# Altium schematic sheet IO_ENC.SchDoc
size 381 x 241 mm; SheetNumber: 8; SheetTotal: 8
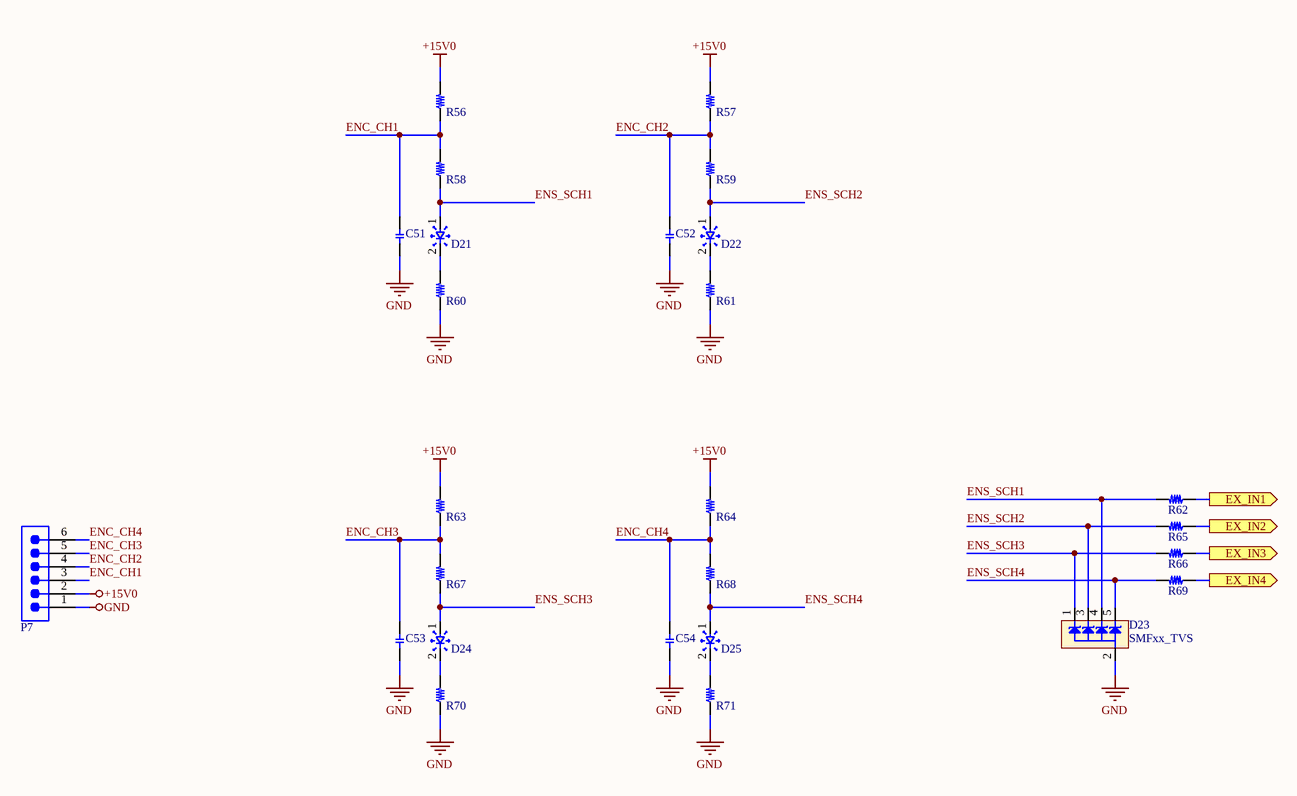
[diagram p0: IO_ENC.SchDoc]

## Parts
C51  CAP_SMD  [C 0603]  (value not drawn)
C52  CAP_SMD  [C 0603]  (value not drawn)
C53  CAP_SMD  [C 0603]  (value not drawn)
C54  CAP_SMD  [C 0603]  (value not drawn)
D21  LED_SMD  [D 0603]  (value not drawn)
D22  LED_SMD  [D 0603]  (value not drawn)
D23  SMFxx_TVS  [SOT353-5]
D24  LED_SMD  [D 0603]  (value not drawn)
D25  LED_SMD  [D 0603]  (value not drawn)
P7  691321300006  [691321300006]  (value not drawn)
R56  RES_SMD  [R 1206]  (value not drawn)
R57  RES_SMD  [R 1206]  (value not drawn)
R58  RES_SMD  [R 0603]  (value not drawn)
R59  RES_SMD  [R 0603]  (value not drawn)
R60  RES_SMD  [R 0603]  (value not drawn)
R61  RES_SMD  [R 0603]  (value not drawn)
R62  RES_SMD  [R 0603]  (value not drawn)
R63  RES_SMD  [R 1206]  (value not drawn)
R64  RES_SMD  [R 1206]  (value not drawn)
R65  RES_SMD  [R 0603]  (value not drawn)
R66  RES_SMD  [R 0603]  (value not drawn)
R67  RES_SMD  [R 0603]  (value not drawn)
R68  RES_SMD  [R 0603]  (value not drawn)
R69  RES_SMD  [R 0603]  (value not drawn)
R70  RES_SMD  [R 0603]  (value not drawn)
R71  RES_SMD  [R 0603]  (value not drawn)

## Ports
EX_IN1 (out), EX_IN2 (out), EX_IN3 (out), EX_IN4 (out)

## Nets
+15V0: P7.2 R56.2 R57.2 R63.2 R64.2
GND: C51.1 C52.1 C53.1 C54.1 D23.2(GND) P7.1 R60.1 R61.1 R70.1 R71.1
ENC_CH1: C51.2 P7.3 R56.1 R58.2
ENC_CH2: C52.2 P7.4 R57.1 R59.2
ENC_CH3: C53.2 P7.5 R63.1 R67.2
ENC_CH4: C54.2 P7.6 R64.1 R68.2
ENS_SCH1: D21.1 D23.4(K3) R58.1 R62.2
ENS_SCH2: D22.1 D23.3(K2) R59.1 R65.2
ENS_SCH3: D23.1(K1) D24.1 R66.2 R67.1
ENS_SCH4: D23.5(K4) D25.1 R68.1 R69.2
EX_IN1: R62.1 ; port EX_IN1
EX_IN2: R65.1 ; port EX_IN2
EX_IN3: R66.1 ; port EX_IN3
EX_IN4: R69.1 ; port EX_IN4
NetD21_2: D21.2 R60.2
NetD22_2: D22.2 R61.2
NetD24_2: D24.2 R70.2
NetD25_2: D25.2 R71.2

## Library data of the parts
P7 = 691321300006: WR-TBL Series 321 Vertical PCB Header, Through Hole, pitch 3.81mm, 6p; Manufacturer: Wurth Elektronik; Pin Number: 6; Rated Current: 10A; Working Voltage: 300V; Modularity: No; ComponentLink1Description: Manufacturer Link; ComponentLink1URL: https://www.we-online.com/redexpert/article/691321300006?ad; ComponentLink2Description: Datasheet; ComponentLink2URL: https://www.we-online.com/redexpert/spec/691321300006?ad; Category: Terminal Blocks; Match Code: WR-TBL; Manufacturer Part Number: 691321300006; Mount: Through Hole; Operating Temperature Max: 105°C; Operating Temperature Min: -40°C; Packaging: Box; Pitch: 3.81mm; Orientation: Vertical; Application: Pluggable; PCB/Cable/Panel: PCB